# EAGLE schematic Kitchen Light Driver 1.1 (EAGLE 6.2)
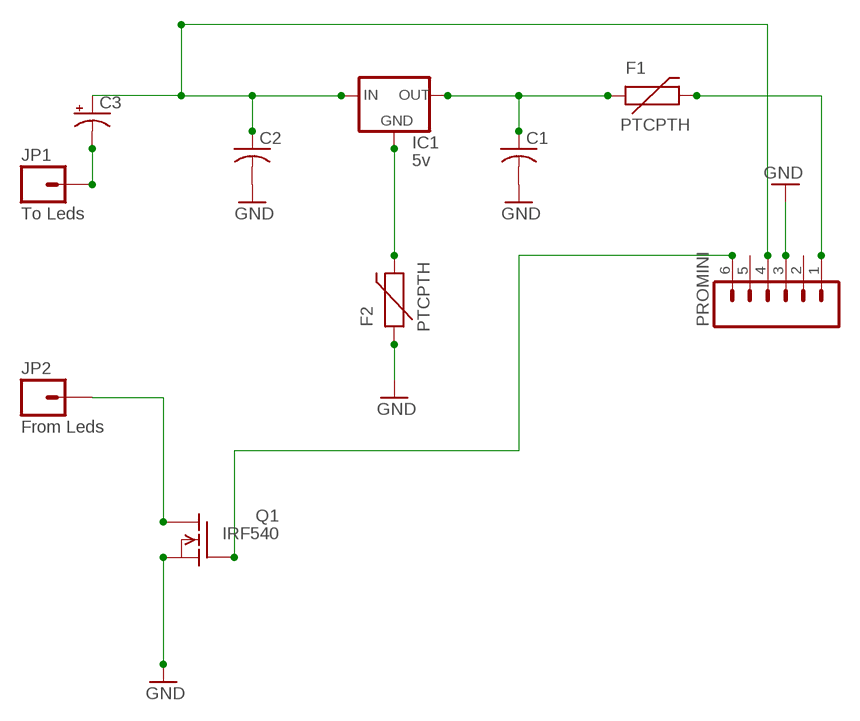
[diagram p0: schematic, sheet 1]

## Parts
C1  C-US025-024X044  [C025-024X044]
C2  C-US025-024X044  [C025-024X044]
C3  CPOL-USE3.5-8  [E3,5-8]
F1  PTCPTH  [PTC]
F2  PTCPTH  [PTC]
IC1  5v  78XXL  [78XXL]
JP1  To Leds  M01PTH  [1X01]
JP2  From Leds  M01PTH  [1X01]
PROMINI  M06SIP  [1X06]
Q1  IRF540  BUZ11  [TO220]

## Nets
GND: C1.2 C2.2 F2.P$1 PROMINI.3 Q1.3(S)
IRF540: PROMINI.6 Q1.1(G)
N$1: C1.1 F1.P$1 IC1.OUT
N$2: F2.P$2 IC1.GND
N$3: F1.P$2 PROMINI.1
N$4: C3.- JP1.1
N$5: JP2.1 Q1.2(D)
N$6: C2.1 C3.+ IC1.IN PROMINI.4
Unconnected: PROMINI.2 PROMINI.5

## Library data of the parts
C1 C2 = resistor:C-US: CAPACITOR, American symbol
C3 = resistor:CPOL-US: POLARIZED CAPACITOR, American symbol
F1 F2 = SparkFun:PTC: Resettable Fuse PTC Resettable Fuse. Spark Fun Electronics SKU : COM-08357
IC1 = v-reg:78XXL: VOLTAGE REGULATOR
JP1 JP2 = SparkFun:M01: Header 1 Standard 1-pin 0.1" header. Use with straight break away headers (SKU : PRT-00116), right angle break away headers (PRT-00553), swiss pins (PRT-00743), machine pins (PRT-00117), and female headers (PRT-00115).
PROMINI = SparkFun:M06: Header 6 Standard 6-pin 0.1" header. Use with straight break away headers (SKU : PRT-00116), right angle break away headers (PRT-00553), swiss pins (PRT-00743), machine pins (PRT-00117), and female headers (PRT-00115). Molex polarized connector foot print use with SKU : PRT-08094 with associated crimp pins and housings. NOTES ON THE VARIANTS LOCK and LOCK_LONGPADS... This footprint was designed to help hold the alignment of a through-hole component (i.e. 6-pin header) while soldering it into place. You may notice that each hole has been shifted either up or down by 0.005 of an inch from it's more standard position (which is a perfectly straight line). This slight alteration caused the pins (the squares in the middle) to touch the edges of the holes. Because they are alternating, it causes a "brace" to hold the component in place. 0.005 has proven to be the perfect amount of "off-center" position when using our standard breakaway headers. Although looks a little odd when you look at the bare footprint, once you have a header in there, the alteration is very hard to notice. Also, if you push a header all the way into place, it is covered up entirely on the bottom side. This idea of altering the position of holes to aid alignment will be further integrated into the Sparkfun Library for other footprints. It can help hold any component with 3 or more connection pins.
Q1 = transistor-fet:BUZ11: N-Channel Enhancement MOSFET 50V; 30A; 0,040Ohm